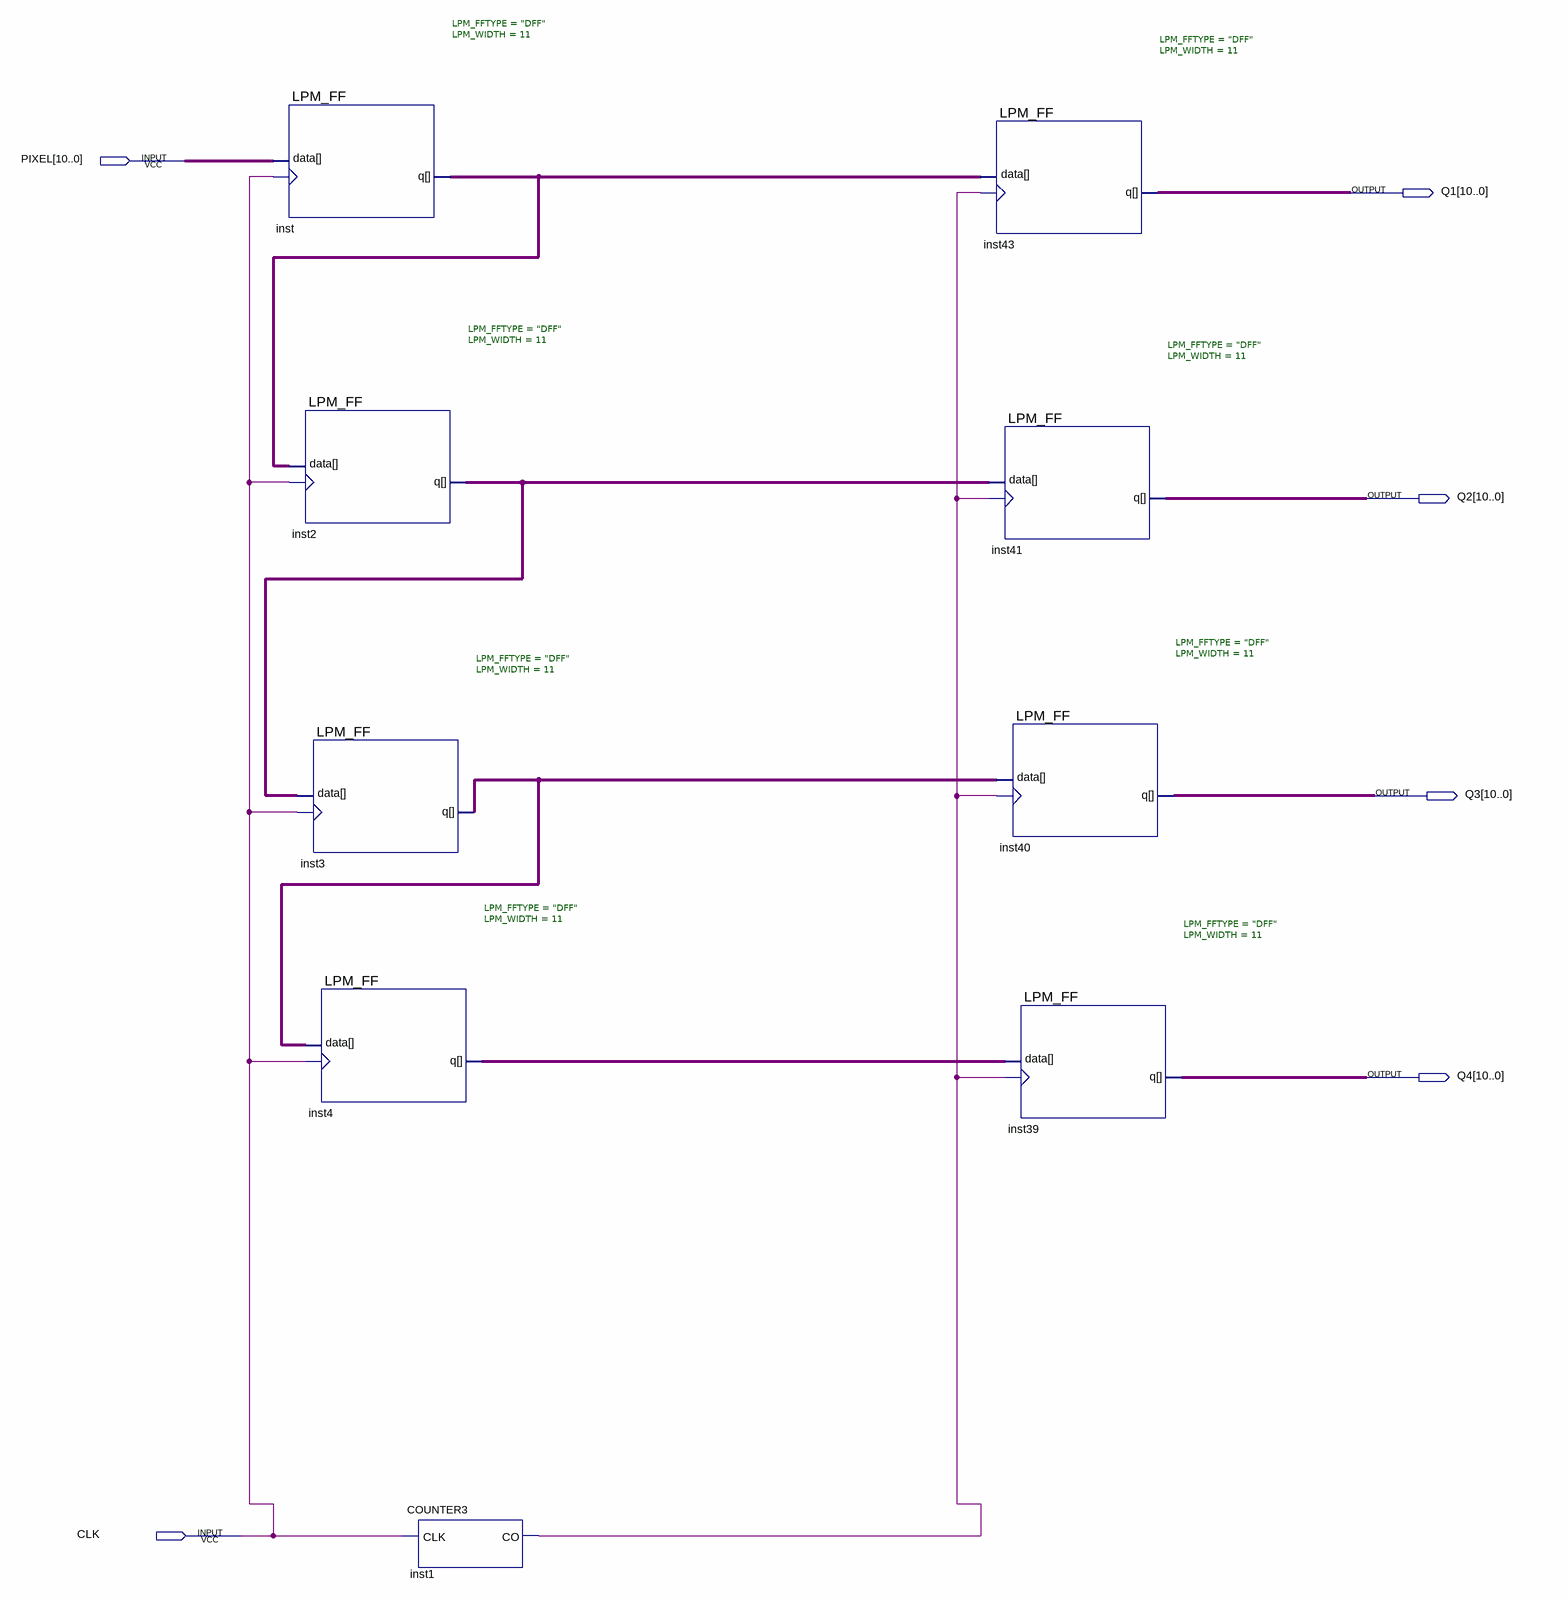
[diagram p0: schematic sheet]
// Quartus schematic SIPO4.bdf as structural Verilog: 9 symbols, 6 pins
module SIPO4 (
  input  [10:0] PIXEL,
  input  CLK,
  output [10:0] Q1,
  output [10:0] Q2,
  output [10:0] Q3,
  output [10:0] Q4
);

  wire inst1_co;
  wire [10:0] inst2_q, inst3_q, inst4_q, inst_q;

  LPM_FF #(.LPM_FFTYPE("DFF"), .LPM_WIDTH(11)) inst (.clock(CLK), .data(PIXEL), .q(inst_q));
  LPM_FF #(.LPM_FFTYPE("DFF"), .LPM_WIDTH(11)) inst2 (.clock(CLK), .data(inst_q), .q(inst2_q));
  LPM_FF #(.LPM_FFTYPE("DFF"), .LPM_WIDTH(11)) inst3 (.clock(CLK), .data(inst2_q), .q(inst3_q));
  LPM_FF #(.LPM_FFTYPE("DFF"), .LPM_WIDTH(11)) inst4 (.clock(CLK), .data(inst3_q), .q(inst4_q));
  COUNTER3 inst1 (.CLK(CLK), .CO(inst1_co));
  LPM_FF #(.LPM_FFTYPE("DFF"), .LPM_WIDTH(11)) inst43 (.clock(inst1_co), .data(inst_q), .q(Q1));
  LPM_FF #(.LPM_FFTYPE("DFF"), .LPM_WIDTH(11)) inst41 (.clock(inst1_co), .data(inst2_q), .q(Q2));
  LPM_FF #(.LPM_FFTYPE("DFF"), .LPM_WIDTH(11)) inst40 (.clock(inst1_co), .data(inst3_q), .q(Q3));
  LPM_FF #(.LPM_FFTYPE("DFF"), .LPM_WIDTH(11)) inst39 (.clock(inst1_co), .data(inst4_q), .q(Q4));
endmodule
